# Altium project Spectrum Analyzer2.PrjPcb
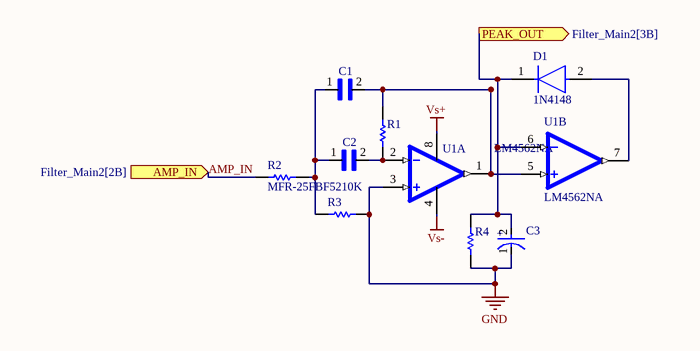
[diagram p0: filter_block.SchDoc]
1 sheet, 9 parts. Net scope: hierarchical (ports join the sheet entries above them; power ports are global).
Board file: Filter_Main2.PcbDoc

## Sheet filter_block.SchDoc
size A4; SheetNumber: 2; SheetTotal: 2

### Parts
C1  ECWFD2W105Q1  [CAPRR1000W60L1260T920H1390]  (value not drawn)
C2  ECWFD2W105Q1  [CAPRR1000W60L1260T920H1390]  (value not drawn)
C3  CAPPRD250W50D630H1250  [CAPPRD250W50D630H1250]  (value not drawn)
D1  1N4148  [FP-017AG-MFG]
R1  MFR-25FBF5210K  [RESA60-630X240]  (value not drawn)
R2  MFR-25FBF5210K  [RESA60-630X240]
R3  MFR-25FBF5210K  [RESA60-630X240]  (value not drawn)
R4  MFR-25FBF5210K  [RESA60-630X240]  (value not drawn)
U1  LM4562NA  [DIP794W45P254L959H508Q8]  (parts A,B of 2)

### Ports
AMP_IN (in, see Filter_Main2[2B]), PEAK_OUT (out, see Filter_Main2[3B])

### Nets
GND: C3.1(C) R3.2 R4.1 U1.3(INA+)
Vs+: U1.8(V+)
Vs-: U1.4(V-)
AMP_IN: R2.1 ; port AMP_IN
NetC1_1: C1.1 C2.1 R2.2 R3.1
NetC1_2: C1.2 R1.2 U1.1(OUTA) U1.5(INB+)
NetC2_2: C2.2 R1.1 U1.2(INA-)
NetC3_2: C3.2(A) D1.1(C) R4.2 U1.6(INB-) ; port PEAK_OUT
NetD1_2: D1.2(A) U1.7(OUTB)

### Notes on the sheet
- (in symbol CAPPRD250W50D630H1250) +

### Library data of the parts
C1 C2 = ECWFD2W105Q1: Capacitor film; Price: None; Availability: Unavailable; Package: None; MP: ECWFD2W105Q1; Value: *
C3 = CAPPRD250W50D630H1250: Capacitor Electrolyte
D1 = CMP-07163-000046-1: DIODE GEN PURP 100V 200MA DO35; Forward Voltage: 1V; Max Power Dissipation: 500mW; Max Reverse Current: 5uA; Forward Current: 300mA; Current: 4A; Reverse Recovery Time: 4ns; Element Configuration: Single; Outside Diameter: 1.85mm; Capacitance: 4pF; Polarity: Standard; Max Forward Surge Current (Ifsm): 1A; Reverse Voltage: 100V; Output Current: 200mA; Average Rectified Current: 200mA; Diameter: 1.91mm; Max Repetitive Reverse Voltage (Vrrm): 100V; Current Rating: 200mA; Case/Package: DO-35; Lead Free: Lead Free; Number of Pins: 2; Recovery Time: 4ns; Packaging: Bulk; Contact Plating: Tin; Voltage: 100V; Mount: Through Hole; Max Surge Current: 4A; Package Quantity: 2000; Width: 1.91mm; Max Reverse Voltage (DC): 100V; Length: 4.56mm; Radiation Hardening: No; Power Dissipation: 500mW; Voltage Rating (DC): 100V; Peak Non-Repetitive Surge Current: 4A; REACH SVHC: No SVHC; Height: 4.56mm; Max Operating Temperature: 175°C; Series: -; Weight: 0.01lb; Min Operating Temperature: -65°C
R1-R4 = CMP-1659-00074-2: Axial Resistor, 10 KOhm, +/- 1%, 0.25 W, -55 to 155 degC, 2-Pin THD, RoHS, Bulk; Manufacturer: Yageo; Temperature Coefficient: 100ppm\/degreesC; Voltage Rating: 250V; Voltage Rating (DC): 200V; Resistance: 10KOhm; Max Power Dissipation: 250mW; Datasheet URL: http://www.yageo.com/documents/recent/Yageo%20LR_MFR_2013.pdf; Packaging: Bulk; RoHSCompliant: True; Mount: ThroughHole; Package Reference: MFR-25; Termination: Axial; Composition: MetalFilm; Number of Terminations: 2; Package Quantity: 200; Mounting Technology: ThroughHole; Length: 0.248inch; Max Operating Temperature: 155degC; Min Operating Temperature: -55degC; Datasheet Version: 04/2013; Lead Free: LeadFree; Manufacturer URL: http://www.yageo.com/; Tolerance: 1%; Power Rating: 250mW; Package Description: 2-Pin Axial Lead, Dia 2.4 mm, Body Length 6.3 mm; Military Standard: Not; Case\/Package: Axial
U1 = LM4562NA: LM4562 2 - Dual Channels per IC Audio Amplifier Evaluation Board; MF: Texas Instruments; SnapEDA_Link: https://www.snapeda.com/parts/LM4562NA/Texas+Instruments/view-part/?ref=snap; Package: DIP-8 Texas Instruments; Value: *; MP: LM4562NA; Check_prices: https://www.snapeda.com/parts/LM4562NA/Texas+Instruments/view-part/?ref=eda